# Altium project LimeSDR-Mini_2v2.PrjPcb (part 4 of 4)
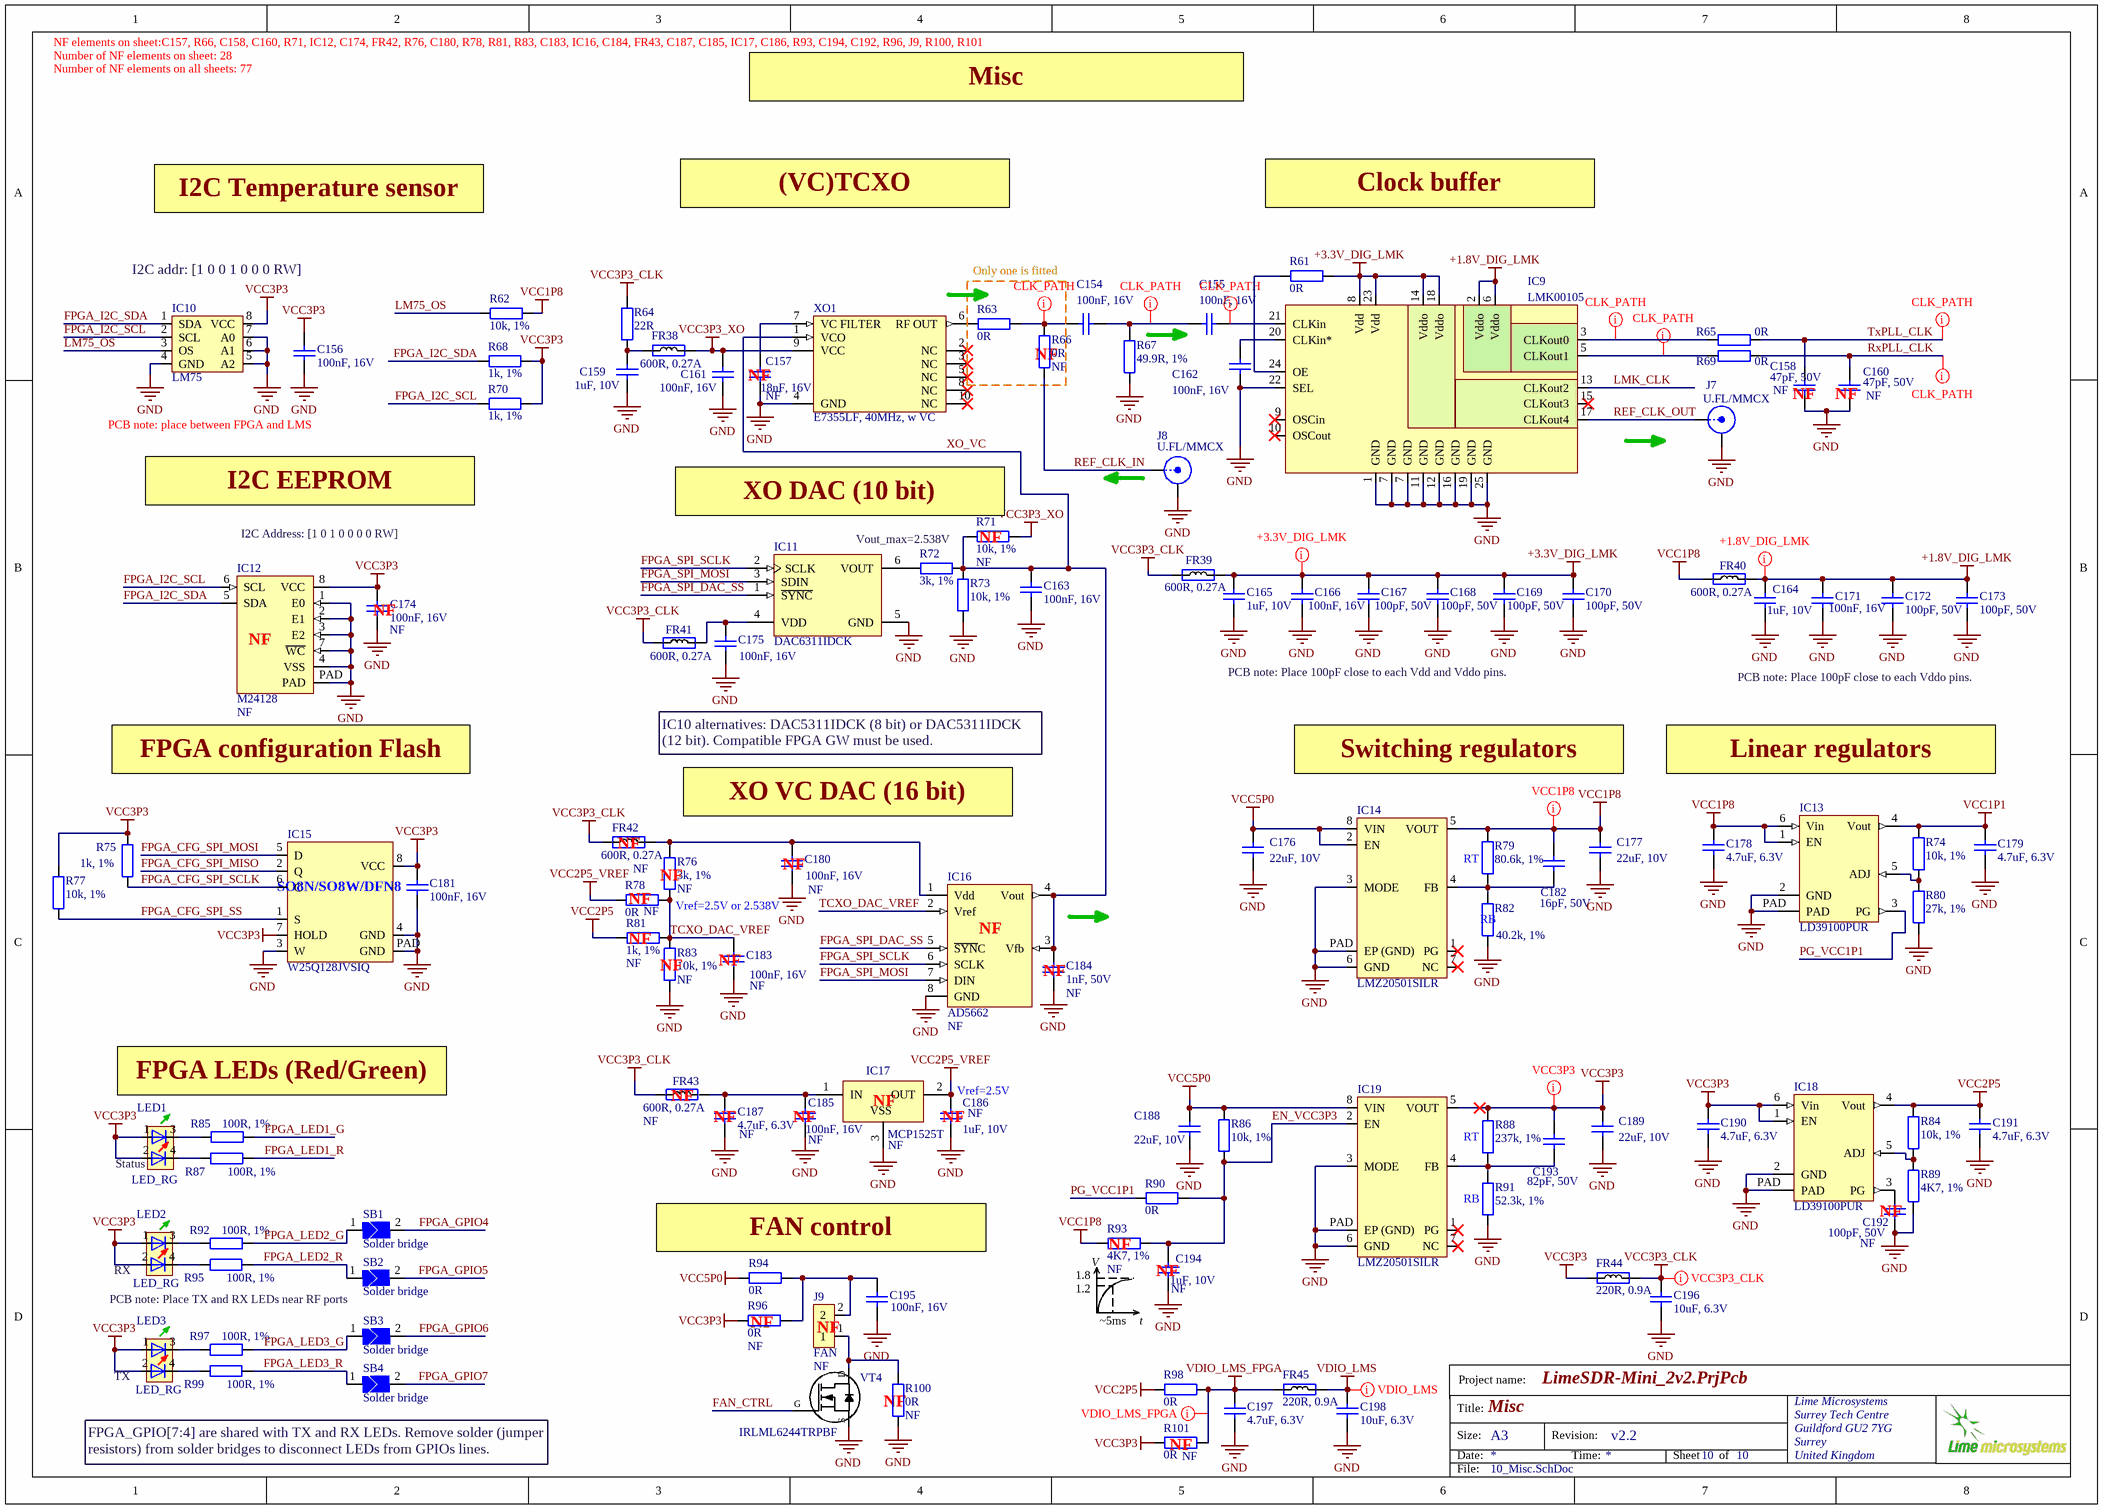
[diagram p109: 10_Misc.SchDoc]

## Sheet 10_Misc.SchDoc: Misc (continued)

### Library data of the parts
C154 C155 C161-C163 C166 C171 = Cap_0402: as C97 on sheet 08_FPGA; Value: 100nF, 16V; Supplier 1: Mouser; Supplier Part Number 1: 81-GRM155R71C104KA88; Case Code - in: 0402; RoHS: RoHS Compliant; Operating Temperature Range: - 55 C to + 125 C; Series: GRM; Termination Style: SMD/SMT; Package / Case: 0402 (1005 metric); Voltage Rating DC: 16 V; Maximum Operating Temperature: + 125 C; Case Code - mm: 1005; Minimum Operating Temperature: - 55 C; Product Category: Low & Medium Capacitance SMD Ceramic Chip Capacitors; Packaging: Reel; Product: General Type MLCCs; Category: Multilayer Ceramic Capacitors MLCC - SMD/SMT; Brand: Murata Electronics; Case Width: 0.5 mm; RoHS - Mouser: Y; Standard Pack Qty: 10000; Minimum Order Quantity: 1; Reeling: True; Manufacturer Part Number 1: GRM155R71C104KA88D
C156 C174 C175 C180 C181 C183 C185 C195 = Cap_0603: as C129 on sheet 09_USB3_0_FIFO; Supplier 1: Mouser; Supplier Part Number 1: 81-GRM155R71C104KA88; Case Code - in: 0402; Manufacturer: Murata Electronics; Category: Multilayer Ceramic Capacitors MLCC - SMD/SMT; Voltage Rating DC: 16 V; Value: 100nF, 16V; Case Code - mm: 1005; Case Width: 0.5 mm; Maximum Operating Temperature: + 125 C; Minimum Operating Temperature: - 55 C; Minimum Order Quantity: 1; Operating Temperature Range: - 55 C to + 125 C; Package / Case: 0402 (1005 metric); Packaging: Reel; Product: General Type MLCCs; Product Category: Low & Medium Capacitance SMD Ceramic Chip Capacitors; Reeling: True; RoHS - Mouser: Y; RoHS: RoHS Compliant; Series: GRM; Standard Pack Qty: 10000; Termination Style: SMD/SMT
  C156 C174 C175 C180 C181 C195: Manufacturer Part Number: GRM155R71C104KA88D
C157 = Cap_0402: Manufacturer: Yageo; Manufacturer Part Number 1: CC0402KRX7R7BB183; Part Description: CAP CER 0.018UF 16V X7R 0402; Temperature Coefficient: X7R; Capacitance: 0.018µF; Tolerance: ±10%; Value: 18nF, 16V; Supplier 1: Digi-Key; Supplier Part Number 1: 311-1706-1-ND; Part Status: Active; Category: Capacitors; Packaging: Cut Tape (CT); Voltage - Rated: 16V; RoHS: RoHS Compliant; Size / Dimension: 0.039" L x 0.020" W (1.00mm x 0.50mm); Package / Case: 0402 (1005 Metric); Mounting Type: Surface Mount, MLCC; Thickness (Max): 0.022" (0.55mm); Applications: General Purpose; Operating Temperature: -55°C ~ 125°C
C158 C160 = Cap_0402: Manufacturer Part Number 1: GRM1555C1H470FA01D; Manufacturer: TDK Corporation; Part Description: 47pF ±1% 50V C0G, NP0 Ceramic Capacitor -55°C ~ 125°C Surface Mount, MLCC 0402 (1005 Metric) 0.039" L x 0.020" W (1.00mm x 0.50mm); Temperature Coefficient: C0G, NP0; Tolerance: ±1%; Value: 47pF, 50V; Supplier 1: Digi-Key; Supplier Part Number 1: 490-6241-1-ND; Package / Case: 0402 (1005 Metric); Voltage - Rated: 50V; Lead Spacing: -; Ratings: -; Mounting Type: Surface Mount, MLCC; Operating Temperature: -55°C ~ 125°C; Thickness (Max): 0.022" (0.55mm); Capacitance: 47pF; Packaging: Cut Tape (CT); Features: -; Applications: General Purpose; Lead Style: -; Size / Dimension: 0.039" L x 0.020" W (1.00mm x 0.50mm); Height - Seated (Max): -; RoHS: RoHS Compliant; Category: Capacitors
C159 C164 C165 C186 C194 = Cap_0402: Manufacturer Part Number 1: C1005X5R1E105K050BC; Manufacturer: TDK; Part Description: 1µF ±10% 10V X5R Ceramic Capacitor -55°C ~ 85°C Surface Mount, MLCC 0402 (1005 Metric) 0.039" L x 0.020" W (1.00mm x 0.50mm); Voltage Rating: 10; Capacitance Tolerance: ± 10%; Product Range: TDK - C Series; Ceramic Capacitor Case: 0402 [1005 Metric]; Capacitance: 1; Dielectric Characteristic: X6; Value: 1uF, 10V; Supplier 1: Digi-Key; Supplier Part Number 1: 445-9066-1-ND; MSL: -; RoHS: YES
C167-C170 C172 C173 C192 = Cap_0402: Manufacturer Part Number 1: CC0402JRNPO9BN101; Manufacturer: Yageo; Part Description: 100pF ±5% 50V C0G, NP0 Ceramic Capacitor -55°C ~ 125°C Surface Mount, MLCC 0402 (1005 Metric) 0.039" L x 0.020" W (1.00mm x 0.50mm); Temperature Coefficient: C0G, NP0; Tolerance: ±5%; Value: 100pF, 50V; Supplier 1: Digi-Key; Supplier Part Number 1: 311-1024-1-ND; RoHS: RoHS Compliant; Category: Capacitors; Applications: General Purpose; Mounting Type: Surface Mount, MLCC; Capacitance: 100pF; Ratings: -; Packaging: Cut Tape (CT); Voltage - Rated: 50V; Size / Dimension: 0.039" L x 0.020" W (1.00mm x 0.50mm); Height - Seated (Max): -; Package / Case: 0402 (1005 Metric); Operating Temperature: -55°C ~ 125°C; Features: -; Lead Spacing: -; Lead Style: -; Thickness (Max): 0.022" (0.55mm)
C176 C177 C188 C189 = Cap_0603: Manufacturer Part Number 1: C1608X5R1A226M080AC; Manufacturer: TDK Corporation; Part Description: 22µF ±20% 10V X5R Ceramic Capacitor -55°C ~ 85°C Surface Mount, MLCC 0603 (1608 Metric) 0.063" L x 0.031" W (1.60mm x 0.80mm); Brand: TDK; Temperature Coefficient / Code: +/- 15 %; Tolerance: 20 %; Type: Multilayer Ceramic Chip Capacitor; Supplier 1: Mouser; Supplier Part Number 1: 810-C1608X5R1A226M; Package / Case: 0603 (1608 metric); Category: Multilayer Ceramic Capacitors MLCC - SMD/SMT; Capacitance: 22 uF; Operating Temperature Range: - 55 C to + 85 C; Case Code - in: 0603; Voltage Rating DC: 10 V; Case Code - mm: 1608; Value: 22uF, 10V
C178 C179 C187 C190 C191 C197 = Cap_0402: Manufacturer: Murata Electronics North America; Manufacturer Part Number 1: GRM155R60J475ME87D; Part Description: 4.7µF ±20% 6.3V X5R Ceramic Capacitor -55°C ~ 85°C Surface Mount, MLCC 0402 (1005 Metric) 0.039" L x 0.020" W (1.00mm x 0.50mm); Tolerance: ±20%; Capacitance: 4.7µF; Temperature Coefficient: X5R; Lead Style: -; Ratings: -; Height - Seated (Max): -; Thickness (Max): 0.022" (0.55mm); Voltage - Rated: 6.3V; Packaging: Cut Tape (CT); Lead Spacing: -; Category: Capacitors; Supplier Part Number 1: 490-5408-1-ND; Applications: General Purpose; Operating Temperature: -55°C ~ 85°C; Mounting Type: Surface Mount, MLCC; Features: Derating Recommended; RoHS: RoHS Compliant; Supplier 1: Digi-Key; Package / Case: 0402 (1005 Metric); Size / Dimension: 0.039" L x 0.020" W (1.00mm x 0.50mm); Value: 4.7uF, 6.3V
C182 = Cap_0402: Part Description: 16 pF ±5% 50V Ceramic Capacitor C0G, NP0 0402 (1005 Metric); Manufacturer: Yageo; Manufacturer Part Number 1: CC0402JRNPO9BN160; Tolerance: 5%; Dielectric: C0G; Value: 16pF, 50V; Supplier 1: Digi-Key; Supplier Part Number 1: 311-1662-1-ND; Stock 1: 168271; Pricing 1: 1=0,10000, 10=0,03700, 50=0,02020, 100=0,01640, 500=0,01174, 1000=0,00922, 2500=0,00838, 5000=0,00771 (USD); RoHS: Yes; Mount: Surface Mount; Case/Package: 0402; Case Code (Imperial): 0402; Case Code (Metric): 1005; Weight: 2.3E-05oz; Min Operating Temperature: -55°C; Max Operating Temperature: 125°C; Capacitance: 16pF; Packaging: Tape and Reel; Voltage Rating (DC): 50V; Voltage Rating: 50V; Termination: SMD/SMT; Resistor Type: Ceramic; Series: CC; Length: 0.039inch; Width: 0.02inch; Thickness: 0.022inch; Depth: 0.5mm; Lead Free: Lead Free; RoHS Compliant: Yes; ComponentLink1URL: http://www.mouser.com/ds/2/447/Yageo_UPY-GP_NP0_16V-to-50V_9-358835.pdf?src-supplier=Mouser; ComponentLink1Description: http://www.mouser.com/ds/2/447/Yageo_UPY-GP_NP0_16V-to-50V_9-358835.pdf?src-supplier=Mouser; ComponentLink2URL: http://www.yageo.com/documents/recent/UPY-GP_NP0_16V-to-50V_16.pdf?src-supplier=Digi-Key; ComponentLink2Description: http://www.yageo.com/documents/recent/UPY-GP_NP0_16V-to-50V_16.pdf?src-supplier=Digi-Key
C184 = Cap_0402: Manufacturer Part Number 1: GCM155R71H102KA37D; Part Description: 1000pF ±10% 50V X7R Ceramic Capacitor -55°C ~ 125°C Surface Mount, MLCC 0402 (1005 Metric) 0.039" L x 0.020" W (1.00mm x 0.50mm); Capacitance: 1000 pF; Type: Automotive Ultra Small MLCC; Tolerance: 10 %; Brand: Murata Electronics; Case Height: 0.5 mm; Case Length: 1 mm; Dielectric: X7R; Temperature Coefficient / Code: +/- 15 %; Value: 1nF, 50V; Supplier 1: Mouser; Supplier Part Number 1: 81-GCM155R71H102KA7D; Case Code - in: 0402; Package / Case: 0402 (1005 metric); Termination Style: SMD/SMT; Packaging: Reel; Operating Temperature Range: - 55 C to + 125 C; Maximum Operating Temperature: + 125 C; Manufacturer: Murata Electronics; Category: Multilayer Ceramic Capacitors MLCC - SMD/SMT; RoHS: RoHS Compliant; Series: GCM; Case Width: 0.5 mm; Voltage Rating DC: 50 V; Case Code - mm: 1005; Product: Automotive MLCCs; Standard Pack Qty: 10000; Reeling: True; RoHS - Mouser: Y; Minimum Order Quantity: 1; Product Category: Automotive Ceramic Chip Capacitors; Minimum Operating Temperature: - 55 C
C193 = Cap_0402: Part Description: 82 pF ±5% 50V Ceramic Capacitor CH 0402 (1005 Metric); Manufacturer: Taiyo Yuden; Manufacturer Part Number 1: UMK105CH820JVHF; Description: Cap Cer 82PF 50V Ch 0402; Value: 82pF, 50V; Supplier 1: Digi-Key; Supplier Part Number 1: 587-5099-1-ND; Stock 1: 10720; Pricing 1: 1=0,10000, 10=0,03000, 50=0,01640, 100=0,01340, 500=0,00954, 1000=0,00750, 2500=0,00682, 5000=0,00627 (USD); RoHS: Yes
C196 C198 = Cap_0603: as C99 on sheet 08_FPGA; Supplier 1: Digi-Key; Supplier Part Number 1: 311-1448-2-ND; Package / Case: 0603 (1608 Metric); Category: Capacitors; Voltage - Rated: 6.3V; Value: 10uF, 6.3V
FR38-FR43 = Ferrite: Manufacturer Part Number 1: BK0603TS601-T; Manufacturer: Taiyo Yuden; Part Description: FERRITE BEAD 600 OHM 0201 1LN; DC Resistance (DCR): 750 mOhm Max; Filter Type: Differential Mode - Single; Impedance @ Frequency: 600 Ohm @ 100MHz; Current Rating: 270mA; Value: 600R@100MHz; Supplier 1: Digi-Key; Supplier Part Number 1: 587-3277-1-ND; Size / Dimension: 0.024" L x 0.012" W (0.60mm x 0.30mm); Package / Case: 0201 (0603 Metric); Height (Max): 0.013" (0.33mm); Mounting Type: Surface Mount; Packaging: Cut Tape (CT); RoHS: RoHS Compliant; Category: Filters
FR44 FR45 = Ferrite: as FR35 on sheet 09_USB3_0_FIFO; Supplier 1: Digi-Key; Package / Case: 0402 (1005 Metric); Category: Filters; Supplier Part Number 1: 445-9329-2-ND; Value: 220R, 0.9A
IC9 = LMK00105: Manufacturer: Texas Instruments; Manufacturer Part Number 1: LMK00105SQ/NOPB; Part Description: IC CLK BUFFER 2:5 200MHZ 24WQFN; Frequency - Max: 200MHz; Voltage - Supply: 2.375 V ~ 3.45 V; Input: HCSL, LVCMOS, LVDS, LVPECL, LVTTL, SSTL, Crystal; Differential - Input:Output: Yes/No; Supplier 1: Digi-Key; Type: Fanout Buffer (Distribution), Multiplexer, Translator; Category: Integrated Circuits (ICs); Operating Temperature: -40°C ~ 85°C; Package / Case: 24-WFQFN Exposed Pad; Supplier Device Package: 24-WQFN (4x4); Supplier Part Number 1: LMK00105SQ/NOPBCT-ND
IC10 = LM75: Manufacturer: NXP Semiconductors; Manufacturer Part Number 1: LM75BTP,147; Part Description: SENSOR TEMPERATURE I2C 8HWSON; Sensing Temperature - Local: -55°C ~ 125°C; Output Type: I²C; Accuracy - Highest (Lowest): ±2°C (±3°C); Voltage - Supply: 2.8 V ~ 5.5 V; Test Condition: -25°C ~ 100°C (-55°C ~ 125°C); Sensor Type: Digital, Local; Resolution: 10 b; Supplier 1: Digi-Key; Operating Temperature: -55°C ~ 125°C; Features: Output Switch, Programmable Limit, Shutdown Mode; Supplier Device Package: 8-HWSON (2x3); Sensing Temperature - Remote: -; Category: Sensors, Transducers; Packaging: Tape & Reel (TR); RoHS: RoHS Compliant; Package / Case: 8-WFDFN Exposed Pad; Supplier Part Number 1: 568-9815-2-ND
IC11 = AD5601BKSZ-REEL7: Single 8-Bit nanoDAC with SPI Interface in LFCSP and SC70, 2.7 to 5.5 V, <100 uA, -40 to +125 degC, KS-6, Pb-Free, Reel; Manufacturer: Texas Instruments; Manufacturer Part Number 1: DAC6311IDCKT; Part Description: 10 Bit Digital to Analog Converter 1 SC-70-6; Max Power Dissipation: 880uW; Max Supply Voltage: 5.5V; Min Supply Voltage: 1.8V; Number of Channels: 1; Operating Supply Voltage: 5V; Settling Time: 6us; Number of Bits: 10; Resolution: 10b; Sampling Rate: 225KS/s; Polarity: Unipolar; Integral Nonlinearity (INL): 0.5LSB; Spurious-free dynamic range (SFDR): 65dB; Signal to Noise Ratio (SNR): 81dB; Nominal Supply Current: 110uA; Output Type: Voltage; ComponentLink1URL: http://www.ti.com/lit/ds/symlink/dac5311.pdf; ComponentLink1Description: http://www.ti.com/lit/ds/symlink/dac5311.pdf; Supplier 1: Digi-Key; Supplier Part Number 1: 296-23716-1-ND; Stock 1: 13410; Pricing 1: 1=2,37000, 10=2,13100, 25=2,01000, 100=1,71250 (USD); RoHS: Yes; Case/Package: SC; Number of Pins: 6; Contact Plating: Gold; Min Operating Temperature: -40°C; Max Operating Temperature: 125°C; Package Quantity: 1; Packaging: Tape and Reel; Number of DAC Channels: 1; Interface: SPI; Number of Converters: 1; Number of D/A Converters: 1; Termination: SMD/SMT; Supply Type: Single; Conversion Rate: 225KS/s; Differential Nonlinearity: 0.5LSB; Length: 2mm; Width: 1.25mm; Height: 0.9mm; Radiation Hardening: No; REACH SVHC: No SVHC; Lead Free: Lead Free; RoHS Compliant: Yes; ComponentLink2URL: https://datasheet.ciiva.com/1362/dac7311-1362880.pdf?src-supplier=Digi-Key; ComponentLink2Description: https://datasheet.ciiva.com/1362/dac7311-1362880.pdf?src-supplier=Digi-Key; ComponentLink3URL: https://datasheet.ciiva.com/4779/sbas442a-125649-4779152.pdf?src-supplier=Mouser; ComponentLink3Description: https://datasheet.ciiva.com/4779/sbas442a-125649-4779152.pdf?src-supplier=Mouser; ComponentLink4URL: https://datasheet.ciiva.com/1494/1833965-1494412.pdf?src-supplier=Element14; ComponentLink4Description: https://datasheet.ciiva.com/1494/1833965-1494412.pdf?src-supplier=Element14; ComponentLink5URL: https://datasheet.ciiva.com/1503/dac5311-1503186.pdf?src-supplier=Farnell; ComponentLink5Description: https://datasheet.ciiva.com/1503/dac5311-1503186.pdf?src-supplier=Farnell; ComponentLink6URL: https://datasheet.ciiva.com/46391/1833965-46391478.pdf?src-supplier=Element14; ComponentLink6Description: https://datasheet.ciiva.com/46391/1833965-46391478.pdf?src-supplier=Element14; ComponentLink7URL: https://datasheet.ciiva.com/1368/dac5311-1368577.pdf?src-supplier=Digi-Key; ComponentLink7Description: https://datasheet.ciiva.com/1368/dac5311-1368577.pdf?src-supplier=Digi-Key; ComponentLink8URL: https://datasheet.ciiva.com/1368/dac5311-1368578.pdf?src-supplier=Digi-Key; ComponentLink8Description: https://datasheet.ciiva.com/1368/dac5311-1368578.pdf?src-supplier=Digi-Key; ComponentLink9URL: https://datasheet.ciiva.com/15146/getdatasheetpartid-213912-15146949.pdf?src-supplier=Verical; ComponentLink9Description: https://datasheet.ciiva.com/15146/getdatasheetpartid-213912-15146949.pdf?src-supplier=Verical
IC12 = M24128-DFMC6TG: Manufacturer: STMicroelectronics; Part Description: EEPROM Memory IC 128Kb (16K x 8) I²C 1MHz 450ns 8-UFDFPN (2x3); Memory Type: Non-Volatile; Memory Format: EEPROM; Memory Size: 128Kb (16K x 8); Write Cycle Time - Word, Page: 5ms; Memory Interface: I²C; Voltage - Supply: 1.7 V ~ 5.5 V; Supplier 1: Digi-Key; Manufacturer Part Number 1: M24128-DFMC6TG; RoHS: RoHS Compliant; Category: Integrated Circuits (ICs); Stock 1: 5894; Pricing 1: 1=0.35, 10=0.348, 100=0.2854, 500=0.27748, 1000=0.27004 (USD); Packaging: Cut Tape (CT); Part Status: Active; Technology: EEPROM; Operating Temperature: -40°C ~ 85°C (TA); Mounting Type: Surface Mount; Package / Case: 8-UFDFN Exposed Pad; Supplier Device Package: 8-UFDFPN (2x3); ComponentLink1URL: http://www.st.com/content/ccc/resource/technical/document/datasheet/59/05/c9/5b/7b/41/48/b6/CD00259167.pdf/files/CD00259167.pdf/jcr:content/translations/en.CD00259167.pdf; ComponentLink1Description: http://www.st.com/content/ccc/resource/technical/document/datasheet/59/05/c9/5b/7b/41/48/b6/CD00259167.pdf/files/CD00259167.pdf/jcr:content/translations/en.CD00259167.pdf; Supplier Part Number 1: 497-15739-1-ND
IC13 IC18 = LD39100PUR: Manufacturer: STMicroelectronics; Part Description: Linear Voltage Regulator IC Positive Adjustable Output 0.8 V ~ 4.5 V 1A 6-DFN (3x3); Output Configuration: Positive; Output Type: Adjustable; Voltage - Input (Max): 5.5V; Voltage - Output (Min/Fixed): 0.8V; Voltage - Output (Max): 4.6V; Voltage Dropout (Max): 0.4V @ 1A; Current - Output: 1A; Current - Supply: 50µA ~ 300µA; PSRR: 70dB ~ 65dB (1kHz ~ 10kHz); Control Features: Enable, Power Good; Protection Features: Over Current, Over Temperature, Short Circuit; Supplier 1: Digi-Key; Manufacturer Part Number 1: LD39100PUR; RoHS: RoHS Compliant; Category: Integrated Circuits (ICs); Stock 1: 27970; Pricing 1: 1=0.85, 10=0.76, 100=0.5923, 500=0.48926, 1000=0.38625 (USD); Packaging: Cut Tape (CT); Part Status: Active; Operating Temperature: -40°C ~ 125°C; Mounting Type: Surface Mount; Package / Case: 6-VDFN Exposed Pad; Supplier Device Package: 6-DFN (3x3); ComponentLink1URL: http://www.st.com/content/ccc/resource/technical/document/datasheet/72/02/e5/ee/df/36/40/5e/CD00233788.pdf/files/CD00233788.pdf/jcr:content/translations/en.CD00233788.pdf; ComponentLink1Description: http://www.st.com/content/ccc/resource/technical/document/datasheet/72/02/e5/ee/df/36/40/5e/CD00233788.pdf/files/CD00233788.pdf/jcr:content/translations/en.CD00233788.pdf; Supplier Part Number 1: 497-11013-1-ND
IC14 IC19 = LMZ20501SILR_DC-DC: Manufacturer: Texas Instruments; Part Description: Non-Isolated PoL Module DC DC Converter 1 Output 0.8 ~ 3.6V 1A 2.7V - 5.5V Input; Number of Outputs: 1; Min Input Voltage: 2.7V; Max Input Voltage: 5.5V; Voltage - Output 1: 3.6V; Max Output Current: 1A; Efficiency: 93%; Max Power Dissipation: 4W; Quiescent Current: 72nA; Switching Frequency: 3MHz; Output Type: Adjustable; Supplier 1: Digi-Key; Supplier Part Number 1: 296-40328-1-ND; Manufacturer Part Number 1: LMZ20501SILR; Stock 1: 8106; Pricing 1: 1=4,48000, 10=4,02000, 25=3,80040, 100=3,29350, 250=3,12464, 500=2,80372, 1000=2,54942 (USD); RoHS: Yes; Mount: Surface Mount; Case/Package: SMD/SMT; Number of Pins: 8; Min Operating Temperature: -40°C; Max Operating Temperature: 125°C; Packaging: Tape and Reel; Output Voltage: 3.6V; Package Quantity: 3000; Features: UVLO,OCP,OTP,SCP; Operating Supply Voltage: 5.5V; Length: 0.14inch; Width: 0.14inch; Height: 0.07inch; Lead Free: Lead Free; RoHS Compliant: Yes; ComponentLink1URL: http://www.ti.com/lit/pdf/snaa214?src-supplier=Digi-Key; ComponentLink1Description: http://www.ti.com/lit/pdf/snaa214?src-supplier=Digi-Key; ComponentLink2URL: http://www.ti.com/lit/ds/symlink/lmz20501.pdf?src-supplier=Digi-Key; ComponentLink2Description: http://www.ti.com/lit/ds/symlink/lmz20501.pdf?src-supplier=Digi-Key; ComponentLink3URL: http://www.ti.com/lit/gpn/lmz20501?src-supplier=Mouser; ComponentLink3Description: http://www.ti.com/lit/gpn/lmz20501?src-supplier=Mouser; ComponentLink4URL: http://www.ti.com/general/docs/lit/getliterature.tsp?genericPartNumber=LMZ20501&&fileType=pdf&src-supplier=Avnet; ComponentLink4Description: http://www.ti.com/general/docs/lit/getliterature.tsp?genericPartNumber=LMZ20501&&fileType=pdf&src-supplier=Avnet
IC15 = M25P40_with_pad: Manufacturer: Winbond; Part Description: FLASH - NOR Memory IC 128Mb (16M x 8) SPI - Quad I/O, QPI, DTR 133 MHz 8-SOIC; Memory Type: FLASH,NOR; Frequency: 104MHz; Interface: SPI,Serial; Supplier 1: Digi-Key; Supplier Part Number 1: W25Q128JVSIQ-ND; Manufacturer Part Number 1: W25Q128JVSIQ; Stock 1: 7729; Pricing 1: 1=1,88000, 10=1,71400, 25=1,66760, 50=1,65880, 100=1,48280, 250=1,47852, 500=1,45618, 1000=1,39437, 5000=1,29820 (USD); RoHS: Yes; Case/Package: SOIC; Min Operating Temperature: -40°C; Max Operating Temperature: 85°C; Packaging: Tray; RoHS Compliant: Yes; ComponentLink1URL: http://www.winbond.com/resource-files/w25q128jv%20revf%2003272018%20plus.pdf?src-supplier=Digi-Key; ComponentLink1Description: http://www.winbond.com/resource-files/w25q128jv%20revf%2003272018%20plus.pdf?src-supplier=Digi-Key
IC16 = AD5662: Manufacturer: Analog Devices Inc.; Manufacturer Part Number 1: AD5662BRJZ-2REEL7; Part Description: IC DAC 16BIT BUFF V-OUT SOT23-8; Number of Bits: 16; Number of D/A Converters: 1; Settling Time: 10µs; Output Type: Voltage - Buffered; Differential Output: No; Data Interface: SPI, DSP; Reference Type: External; Voltage - Supply, Analog: 2.7 V ~ 5.5 V; INL/DNL (LSB): ±8, ±1 (Max); Architecture: String DAC; Supplier 1: Digi-Key; RoHS: RoHS Compliant; Category: Integrated Circuits (ICs); Stock 1: 2784; Pricing 1: 1=7.55, 10=6.821, 100=5.6469, 500=4.91722, 1000=4.28274 (USD); Packaging: Cut Tape (CT); Part Status: Active; Voltage - Supply, Digital: 2.7 V ~ 5.5 V; Operating Temperature: -40°C ~ 125°C; Package / Case: SOT-23-8; Supplier Device Package: SOT-23-8; ComponentLink1URL: http://www.analog.com/media/en/technical-documentation/data-sheets/AD5662.pdf; ComponentLink1Description: http://www.analog.com/media/en/technical-documentation/data-sheets/AD5662.pdf; Supplier Part Number 1: AD5662BRJZ-2REEL7CT-ND
IC17 = MCP1525T-I/TT: 2.5V Voltage Reference, 3-Pin SOT-23, Industrial Temperature, Tape and Reel; Manufacturer: Microchip Technology; Part Description: Series Voltage Reference IC ±1% 2mA SOT-23-3; Reference Type: Series; Output Type: Fixed; Current - Output: 2mA; Tolerance: ±1%; Temperature Coefficient: 50ppm/°C; Noise - 0.1Hz to 10Hz: 90µVp-p; Noise - 10Hz to 10kHz: 500µVrms; Voltage - Input: 2.7 V ~ 5.5 V; Current - Supply: 120µA; PackageDescription: Series Voltage Reference IC ±1% 2mA SOT-23-3; Supplier 1: Digi-Key; Manufacturer Part Number 1: MCP1525T-I/TT; RoHS: RoHS Compliant; Category: Integrated Circuits (ICs); Stock 1: 16612; Pricing 1: 1=0.77, 25=0.64, 100=0.58 (USD); Packaging: Digi-Reel®; Part Status: Active; Voltage - Output (Min/Fixed): 2.5V; Voltage - Output (Max): -; Current - Cathode: -; Operating Temperature: -40°C ~ 85°C (TA); Mounting Type: Surface Mount; Package / Case: TO-236-3, SC-59, SOT-23-3; Supplier Device Package: SOT-23-3; ComponentLink1URL: http://www.microchip.com/mymicrochip/filehandler.aspx?ddocname=en011331; ComponentLink1Description: http://www.microchip.com/mymicrochip/filehandler.aspx?ddocname=en011331; Supplier Part Number 1: MCP1525T-I/TTDKR-ND
J7 J8 = RF_IF_connector: CONN UMC RCPT STR 50 OHM SMD; Manufacturer: Molex, LLC; Manufacturer Part Number 1: 0734120110; Part Description: Ultra Miniature Coaxial Connector Receptacle, Male Pin 50 Ohm Surface Mount Solder; Body Finish: Nickel; Body Material: Phosphor Bronze; Center Contact Material: Brass; Center Contact Plating: Gold; Connector Style: Ultra Miniature Coaxial; Connector Type: Jack, Male Pin; Contact Termination: Solder; Dielectric Material: Liquid Crystal Polymer (LCP); Frequency - Max: 6GHz; Impedance: 50 Ohm; Voltage Rating: 60V; Cable Group: -; Category: Connectors, Interconnects; Fastening Type: Snap-On; Features: -; Housing Color: Silver; Ingress Protection: -; Mounting Type: Surface Mount; Operating Temperature: -40°C ~ 90°C; Packaging: Cut Tape (CT); RoHS: RoHS Compliant; Shield Termination: Solder; Supplier 1: Digi-Key; Supplier Part Number 1: WM5587CT-ND
J9 = Jumper: Manufacturer Part Number 1: 961102-6404-AR; Part Description: 2 Positions Header, Unshrouded Connector 0.100" (2.54mm) Through Hole Gold; Manufacturer: 3M; Connector Type: Header, Unshrouded; Supplier 1: Digi-Key; Supplier Part Number 1: 3M9447-ND; Contact Type: Male Pin; Color: Black; Mounting Type: Through Hole; Category: Connectors, Interconnects; Contact Finish: Gold
LED1-LED3 = LED_green_red_SMD: Manufacturer Part Number 1: HSMF-C165; Manufacturer: Avago Technologies US Inc.; Part Description: LED GREEN/RED DIFFUSED 0603 SMD; Millicandela Rating: 15mcd Green, 10mcd Red; Lens Transparency: Diffused; Lens Color: White; Lens Style/Size: Rectangle with Flat Top, 1.60mm x 0.80mm; Wavelength - Peak: 570nm Green, 636nm Red; Wavelength - Dominant: 572nm Green, 621nm Red; Viewing Angle: 120°; Voltage - Forward (Vf) (Typ): 2.2V Green, 1.95V Red; Current - Test: 20mA; Color: Green, Red; Supplier 1: Digi-Key; Height (Max): 0.50mm; Packaging: Cut Tape (CT); Category: Optoelectronics; Mounting Type: Surface Mount; Package / Case: 0603 (1608 Metric); Size / Dimension: 1.60mm L x 0.80mm W; Supplier Device Package: *; RoHS: RoHS Compliant; Supplier Part Number 1: 516-1419-1-ND
R61 R63 R66 R78 R90 R94 R96 R100 = Res_0402: as R53 on sheet 09_USB3_0_FIFO; Value: 0R; Supplier 1: Digi-Key; Supplier Part Number 1: 311-0.0JRTR-ND; Category: Resistors; Temperature Coefficient: -; Features: Moisture Resistant; Supplier Device Package: 0402; Height: 0.016" (0.40mm); Package / Case: 0402 (1005 Metric); Operating Temperature: -55°C ~ 155°C; Size / Dimension: 0.039" L x 0.020" W (1.00mm x 0.50mm); Composition: Thick Film; Packaging: Tape & Reel (TR); Number of Terminations: 2; RoHS: RoHS Compliant
R62 R71 R73 R74 R77 R83 R84 R86 = Res_0402: as R54-R56 on sheet 09_USB3_0_FIFO; Value: 10k, 1%; Supplier 1: Digi-Key; Supplier Part Number 1: 311-10.0KLRTR-ND; Resistance (Ohms): 10k; Packaging: Tape & Reel (TR); RoHS: RoHS Compliant; Package / Case: 0402 (1005 Metric); Tolerance: ±1%; Operating Temperature: -55°C ~ 155°C; Size / Dimension: 0.039" L x 0.020" W (1.00mm x 0.50mm); Number of Terminations: 2; Category: Resistors; Height: 0.016" (0.40mm); Supplier Device Package: 0402; Features: Moisture Resistant; Composition: Thick Film
R64 = Res_0402: as R59 on sheet 09_USB3_0_FIFO; Supplier 1: Digi-Key; Supplier Part Number 1: 311-22.0LRTR-ND; Supplier Device Package: 0402; Composition: Thick Film; Category: Resistors; Value: 22R
R65 R69 R98 R101 = Res_0402: as R42-R46 on sheet 08_FPGA; Supplier 1: Digi-Key; Supplier Part Number 1: 311-0.0JRTR-ND; Composition: Thick Film; Package / Case: 0402 (1005 Metric); Category: Resistors; Value: 0R; Features: Moisture Resistant; Height: 0.016" (0.40mm); Number of Terminations: 2; Operating Temperature: -55°C ~ 155°C; Packaging: Tape & Reel (TR); RoHS: RoHS Compliant; Size / Dimension: 0.039" L x 0.020" W (1.00mm x 0.50mm); Supplier Device Package: 0402; Temperature Coefficient: -
R67 = Res_0402: Manufacturer: Samsung Electro-Mechanics America, Inc.; Manufacturer Part Number 1: RC1005F49R9CS; Part Description: RES SMD 49.9 OHM 1% 1/16W 0402; Temperature Coefficient: ±100ppm/°C; Resistance (Ohms): 49.9; Power (Watts): 0.063W, 1/16W; Number of Terminations: 2; Size / Dimension: 0.039" L x 0.020" W (1.00mm x 0.50mm); Supplier Device Package: 0402 (1005 Metric); RoHS: RoHS Compliant; Supplier Part Number 1: 1276-3469-6-ND; Features: -; Packaging: Digi-Reel®; Tolerance: ±1%; Height: 0.016" (0.40mm); Category: Resistors; Composition: Thick Film; Package / Case: 0402 (1005 Metric); Supplier 1: Digi-Key; Operating Temperature: -55°C ~ 155°C; Value: 49.9R, 1%
R68 R70 R75 R81 = Res_0402: Manufacturer: Stackpole Electronics Inc; Manufacturer Part Number 1: RMCF0402FT1K00; Part Description: RES SMD 1K OHM 1% 1/16W 0402; Temperature Coefficient: ±100ppm/°C; Power (Watts): 0.063W, 1/16W; Value: 1k, 1%; Supplier 1: Digi-Key; Supplier Part Number 1: RMCF0402FT1K00TR-ND; Package / Case: 0402 (1005 Metric); Supplier Device Package: 0402; Height: 0.016" (0.40mm); Size / Dimension: 0.039" L x 0.020" W (1.00mm x 0.50mm); Number of Terminations: 2; Category: Resistors; Composition: Thick Film; Resistance (Ohms): 1k; Tolerance: ±1%; Operating Temperature: -55°C ~ 155°C; RoHS: RoHS Compliant
  R68 R70 R75: Packaging: Cut Tape (CT); Features: Moisture Resistant
  R81: Packaging: Tape & Reel (TR); Features: -
R72 R76 = Res_0402: Manufacturer: Vishay Dale; Part Description: RES SMD 3K OHM 1% 1/16W 0402; Manufacturer Part Number 1: RMCF0402FT3K00; Temperature Coefficient: ±100ppm/°C; Power (Watts): 0.063W, 1/16W; Value: 3k, 1%; Category: Resistors; Tolerance: ±1%; RoHS: RoHS Compliant; Composition: Thick Film; Number of Terminations: 2; Operating Temperature: -55°C ~ 155°C; Supplier Device Package: 0402 (1005 Metric); Supplier Part Number 1: RMCF0402FT3K00TR-ND; Packaging: Cut Tape (CT); Supplier 1: Digi-Key; Package / Case: 0402 (1005 Metric); Features: Automotive AEC-Q200; Resistance (Ohms): 3k; Height: 0.016" (0.40mm); Size / Dimension: 0.039" L x 0.020" W (1.00mm x 0.50mm)
R79 = Res_0402: Part Description: 80.6 kOhms ±1% 0.063W, 1/16W Chip Resistor 0402 (1005 Metric) Automotive AEC-Q200 Thick Film; Manufacturer: Stackpole Electronics; Manufacturer Part Number 1: RMCF0402FT80K6; Resistance: 80.6kR; Max Power Dissipation: 63mW; Temperature Coefficient: 100ppm/°C; Value: 80.6k, 1%; Supplier 1: Digi-Key; Supplier Part Number 1: RMCF0402FT80K6CT-ND; Stock 1: 329079; Pricing 1: 1=0,10000, 10=0,01300, 100=0,00550, 1000=0,00246, 2500=0,00213, 5000=0,00176 (USD); RoHS: Yes; Mount: Surface Mount; Case/Package: 0402; Case Code (Metric): 1005; Case Code (Imperial): 0402; Contact Plating: Tin,Matte; Min Operating Temperature: -55°C; Max Operating Temperature: 155°C; Tolerance: 1%; Features: Automotive AEC-Q200; Packaging: Tape and Reel; Resistor Type: Thick Film; Number of Terminations: 2; Series: RMCF; Length: 0.039inch; Width: 0.02inch; Height: 0.016inch; Radiation Hardening: No; Lead Free: Lead Free; RoHS Compliant: Yes; ComponentLink1URL: https://www.seielect.com/catalog/SEI-Packaging.pdf?src-supplier=Digi-Key; ComponentLink1Description: https://www.seielect.com/catalog/SEI-Packaging.pdf?src-supplier=Digi-Key; ComponentLink2URL: https://www.seielect.com/catalog/SEI-RMCF_RMCP.pdf?src-supplier=Avnet; ComponentLink2Description: https://www.seielect.com/catalog/SEI-RMCF_RMCP.pdf?src-supplier=Avnet; ComponentLink3URL: https://www.seielect.com/Catalog/SEI-RMCF_RMCP.pdf?src-supplier=Digi-Key; ComponentLink3Description: https://www.seielect.com/Catalog/SEI-RMCF_RMCP.pdf?src-supplier=Digi-Key
R80 = Res_0402: Manufacturer: Yageo; Manufacturer Part Number 1: RC0402FR-0727KL; Part Description: 27 kOhms ±1% 0.063W, 1/16W Chip Resistor 0402 (1005 Metric) Moisture Resistant Thick Film; Resistance: 27kR; Power Rating: 63mW; Temperature Coefficient: 100ppm/°C; Voltage Rating: 50V; ComponentLink1URL: http://www.yageo.com/documents/recent/PYu-RC_Group_51_RoHS_L_7.pdf; ComponentLink1Description: http://www.yageo.com/documents/recent/PYu-RC_Group_51_RoHS_L_7.pdf; Supplier 1: Digi-Key; Supplier Part Number 1: 311-27.0KLRCT-ND; Stock 1: 1102573; Pricing 1: 1=0,10000, 10=0,01600, 100=0,00660, 1000=0,00299, 2500=0,00259, 5000=0,00214 (USD); RoHS: Yes; Case/Package: 0402; Case Code (Imperial): 0402; Case Code (Metric): 1005; Size Code: 0402; Min Operating Temperature: -55°C; Max Operating Temperature: 155°C; Tolerance: 1%; Packaging: Tape and Reel; Package Quantity: 10000; Termination: SMD/SMT; Resistor Type: Thick Film; Number of Terminations: 2; Max Power Dissipation: 63mW; Features: Moisture Resistant; Series: RC; Resistance Tolerance: 1%; Construction: Rectangular; Technology: THICK FILM; Length: 1mm; Width: 0.02inch; Height: 0.016inch; Depth: 0.5mm; REACH SVHC: Unknown; Lead Free: Lead Free; Military Standard: Not; RoHS Compliant: Yes; Value: 27k, 1%
R82 = Res_0402: Part Description: 40.2 kOhms ±1% 0.063W, 1/16W Chip Resistor 0402 (1005 Metric) Moisture Resistant Thick Film; Manufacturer: Yageo; Manufacturer Part Number 1: RC0402FR-0740K2L; Resistance: 40.2kR; Power Rating: 62.5mW; Voltage Rating: 50V; Temperature Coefficient: 100ppm/°C; Max Power Dissipation: 63mW; Value: 40.2k, 1%; Supplier 1: Digi-Key; Supplier Part Number 1: 311-40.2KLRCT-ND; Stock 1: 2895359; Pricing 1: 1=0,10000, 10=0,01500, 100=0,00600, 1000=0,00267, 2500=0,00232, 5000=0,00192 (USD); RoHS: Yes; Case/Package: 0402; Case Code (Metric): 1005; Case Code (Imperial): 0402; Contact Plating: Tin,Matte; Size Code: 0402; Min Operating Temperature: -55°C; Max Operating Temperature: 155°C; Package Quantity: 1; Tolerance: 1%; Packaging: Tape and Reel; Resistor Type: Thick Film; Number of Terminations: 2; Termination: SMD/SMT; Features: Moisture Resistant; Series: RC; Construction: Rectangular; Voltage Rating (DC): 50V; Length: 0.039inch; Width: 0.02inch; Height: 0.016inch; Depth: 0.5mm; Military Standard: Not; Lead Free: Lead Free; RoHS Compliant: Yes; ComponentLink1URL: https://datasheet.ciiva.com/2453/pyu-r-int-thick-7-2453437.pdf?src-supplier=Digi-Key; ComponentLink1Description: https://datasheet.ciiva.com/2453/pyu-r-int-thick-7-2453437.pdf?src-supplier=Digi-Key; ComponentLink2URL: https://datasheet.ciiva.com/2453/pyu-r-int-thick-7-2453438.pdf?src-supplier=Digi-Key; ComponentLink2Description: https://datasheet.ciiva.com/2453/pyu-r-int-thick-7-2453438.pdf?src-supplier=Digi-Key; ComponentLink3URL: https://datasheet.ciiva.com/2453/pyu-r-int-thick-7-2453436.pdf?src-supplier=Digi-Key; ComponentLink3Description: https://datasheet.ciiva.com/2453/pyu-r-int-thick-7-2453436.pdf?src-supplier=Digi-Key; ComponentLink4URL: https://datasheet.ciiva.com/5557/pyu-rc0402-51-rohs-l-6-r-5557981.pdf?src-supplier=Mouser; ComponentLink4Description: https://datasheet.ciiva.com/5557/pyu-rc0402-51-rohs-l-6-r-5557981.pdf?src-supplier=Mouser; ComponentLink5URL: https://datasheet.ciiva.com/8889/pyu-rc0402-51-rohs-l-6-8889263.pdf?src-supplier=Avnet; ComponentLink5Description: https://datasheet.ciiva.com/8889/pyu-rc0402-51-rohs-l-6-8889263.pdf?src-supplier=Avnet; ComponentLink6URL: https://datasheet.ciiva.com/16744/pyu-rc0402-51-rohs-l-6-r-16744286.pdf?src-supplier=Future+Electronics; ComponentLink6Description: https://datasheet.ciiva.com/16744/pyu-rc0402-51-rohs-l-6-r-16744286.pdf?src-supplier=Future+Electronics
R85 R87 R92 R95 R97 R99 = Res_0402: Manufacturer Part Number 1: RMCF0402FT100R; Manufacturer: Stackpole Electronics Inc.; Part Description: RES SMD 100 OHM 1% 1/16W 0402; Power (Watts): 0.063W, 1/16W; Temperature Coefficient: ±100ppm/°C; Resistance (Ohms): 100; Value: 100R, 1%; Supplier 1: Digi-Key; Supplier Part Number 1: RMCF0402FT100RDKR-ND; Packaging: Digi-Reel®; Composition: Thick Film; Number of Terminations: 2; Package / Case: 0402 (1005 Metric); RoHS: RoHS Compliant; Category: Resistors; Size / Dimension: 0.039" L x 0.020" W (1.00mm x 0.50mm); Tolerance: ±1%; Supplier Device Package: 0402; Features: -; Height: 0.016" (0.40mm); Operating Temperature: -55°C ~ 155°C
R88 = Res_0402: Part Description: 237 kOhms ±1% 0.063W, 1/16W Chip Resistor 0402 (1005 Metric) Moisture Resistant Thick Film; Manufacturer: Yageo; Manufacturer Part Number 1: RC0402FR-07237KL; Resistance: 237kR; Power Rating: 62.5mW; Voltage Rating: 50V; Temperature Coefficient: 100ppm/°C; Max Power Dissipation: 63mW; Value: 237k, 1%; Supplier 1: Digi-Key; Supplier Part Number 1: YAG3064CT-ND; Stock 1: 306971; Pricing 1: 1=0,10000, 10=0,01500, 100=0,00600, 1000=0,00267, 2500=0,00232, 5000=0,00192 (USD); RoHS: Yes; Case/Package: 0402; Case Code (Imperial): 0402; Case Code (Metric): 1005; Contact Plating: Tin,Matte; Size Code: 0402; Min Operating Temperature: -55°C; Max Operating Temperature: 155°C; Tolerance: 1%; Packaging: Tape and Reel; Resistor Type: Thick Film; Termination: SMD/SMT; Number of Terminations: 2; Features: Moisture Resistant; Series: RC; Construction: Rectangular; Length: 1mm; Width: 0.5mm; Height: 0.016inch; Depth: 0.5mm; Military Standard: Not; Lead Free: Lead Free; RoHS Compliant: Yes; ComponentLink1URL: https://datasheet.ciiva.com/17419/pyu-rc0402-51-rohs-l-6-r-17419479.pdf?src-supplier=Future+Electronics; ComponentLink1Description: https://datasheet.ciiva.com/17419/pyu-rc0402-51-rohs-l-6-r-17419479.pdf?src-supplier=Future+Electronics
R89 R93 = Res_0402: as R47 on sheet 08_FPGA; Supplier 1: Digi-Key; Supplier Part Number 1: 311-4.7KLRCT-ND; RoHS: RoHS Compliant; Category: Resistors; Stock 1: 4788231; Pricing 1: 1=0.1, 10=0.014, 100=0.0056, 1000=0.00253, 2500=0.0022, 5000=0.00181 (USD); Packaging: Cut Tape (CT); Part Status: Active; Tolerance: ±1%; Composition: Thick Film; Features: Moisture Resistant; Operating Temperature: -55°C ~ 155°C; Package / Case: 0402 (1005 Metric); Supplier Device Package: 0402; Size / Dimension: 0.039" L x 0.020" W (1.00mm x 0.50mm); Height - Seated (Max): 0.016" (0.40mm); Failure Rate: -; ComponentLink1URL: http://www.yageo.com/documents/recent/PYu-RC_Group_51_RoHS_L_7.pdf; ComponentLink1Description: http://www.yageo.com/documents/recent/PYu-RC_Group_51_RoHS_L_7.pdf; Value: 4K7, 1%
R91 = Res_0402: Part Description: Thick Film Resistors - SMD 0402 52.3Kohms 1% AEC-Q20; Manufacturer: Panasonic; Manufacturer Part Number 1: ERJ-2RKF5232X; Resistance: 52.3kR; Voltage Rating: 50V; Power Rating: 100mW; Temperature Coefficient: 100ppm/°C; Value: 52.3k, 1%; ComponentLink1URL: https://datasheet.ciiva.com/6067/1686128-6067913.pdf?src-supplier=Farnell; ComponentLink1Description: https://datasheet.ciiva.com/6067/1686128-6067913.pdf?src-supplier=Farnell; ComponentLink2URL: https://datasheet.ciiva.com/7983/1018594-7983494.pdf?src-supplier=Element14; ComponentLink2Description: https://datasheet.ciiva.com/7983/1018594-7983494.pdf?src-supplier=Element14; ComponentLink3URL: https://datasheet.ciiva.com/2453/pyu-r-int-thick-7-2453602.pdf?src-supplier=Digi-Key; ComponentLink3Description: https://datasheet.ciiva.com/2453/pyu-r-int-thick-7-2453602.pdf?src-supplier=Digi-Key; ComponentLink4URL: https://datasheet.ciiva.com/2453/pyu-r-int-thick-7-2453603.pdf?src-supplier=Digi-Key; ComponentLink4Description: https://datasheet.ciiva.com/2453/pyu-r-int-thick-7-2453603.pdf?src-supplier=Digi-Key; ComponentLink5URL: https://datasheet.ciiva.com/2453/pyu-r-int-thick-7-2453601.pdf?src-supplier=Digi-Key; ComponentLink5Description: https://datasheet.ciiva.com/2453/pyu-r-int-thick-7-2453601.pdf?src-supplier=Digi-Key; ComponentLink6URL: https://datasheet.ciiva.com/7849/1018594-7849837.pdf?src-supplier=Element14; ComponentLink6Description: https://datasheet.ciiva.com/7849/1018594-7849837.pdf?src-supplier=Element14; ComponentLink7URL: https://datasheet.ciiva.com/7849/1018594-7849836.pdf?src-supplier=Element14; ComponentLink7Description: https://datasheet.ciiva.com/7849/1018594-7849836.pdf?src-supplier=Element14; ComponentLink8URL: https://datasheet.ciiva.com/15189/getdatasheetpartid-326416-15189356.pdf?src-supplier=Verical; ComponentLink8Description: https://datasheet.ciiva.com/15189/getdatasheetpartid-326416-15189356.pdf?src-supplier=Verical; ComponentLink9URL: https://datasheet.ciiva.com/16741/pyu-rc0402-51-rohs-l-6-r-16741080.pdf?src-supplier=Future+Electronics; ComponentLink9Description: https://datasheet.ciiva.com/16741/pyu-rc0402-51-rohs-l-6-r-16741080.pdf?src-supplier=Future+Electronics; Supplier 1: Mouser; Supplier Part Number 1: 667-ERJ-2RKF5232X; Stock 1: 161816; Pricing 1: 1=0,10000, 10=0,03400, 50=0,03400, 100=0,01400, 1000=0,00700, 10000=0,00400 (USD); RoHS: Yes; Mount: Surface Mount; Case/Package: 0402; Case Code (Imperial): 0402; Case Code (Metric): 1005; Contact Plating: Tin; Min Operating Temperature: -55°C; Max Operating Temperature: 155°C; Tolerance: 1%; Packaging: Tape and Reel; Package Quantity: 10000; Termination: SMD/SMT; Resistor Type: Thick Film; Number of Terminations: 2; Max Power Dissipation: 100mW; Voltage Rating (DC): 50V; Features: Automotive AEC-Q200; Series: ERJ; Construction: Rectangular; Resistance Tolerance: 1%; Length: 1mm; Width: 0.5mm; Height: 0.35mm; Depth: 0.5mm; Ratings: AEC-Q200; Reach SVHC Compliant: Yes; Military Standard: Not; Lead Free: Lead Free; RoHS Compliant: Yes; ComponentLink10URL: https://datasheet.ciiva.com/3883/3984280s8821682n1386-3883650.pdf?src-supplier=Arrow+Electronics; ComponentLink10Description: https://datasheet.ciiva.com/3883/3984280s8821682n1386-3883650.pdf?src-supplier=Arrow+Electronics; ComponentLink11URL: https://datasheet.ciiva.com/6201/426256-6201381.pdf?src-supplier=Farnell; ComponentLink11Description: https://datasheet.ciiva.com/6201/426256-6201381.pdf?src-supplier=Farnell; ComponentLink12URL: https://datasheet.ciiva.com/9188/aoa0000ce2-9188938.pdf?src-supplier=Avnet; ComponentLink12Description: https://datasheet.ciiva.com/9188/aoa0000ce2-9188938.pdf?src-supplier=Avnet; ComponentLink13URL: https://datasheet.ciiva.com/46389/426256-46389115.pdf?src-supplier=Element14; ComponentLink13Description: https://datasheet.ciiva.com/46389/426256-46389115.pdf?src-supplier=Element14; ComponentLink14URL: https://datasheet.ciiva.com/43460/426256-43460332.pdf?src-supplier=Farnell; ComponentLink14Description: https://datasheet.ciiva.com/43460/426256-43460332.pdf?src-supplier=Farnell; ComponentLink15URL: https://datasheet.ciiva.com/16781/70260748-16781070.pdf?src-supplier=Allied+Electronics; ComponentLink15Description: https://datasheet.ciiva.com/16781/70260748-16781070.pdf?src-supplier=Allied+Electronics
SB1-SB4 = SOLDER_BRIDGE_TRIANGULAR: Can be shorted out using solder paste or 0402-1206 resistor; Part Description: RES SMD 0.0OHM JUMPER 1/16W 0402; Manufacturer: Yageo; Manufacturer Part Number 1: RC0402JR-070RL; Power (Watts): 0.063W, 1/16W; Resistance (Ohms): 0.0; Tolerance: Jumper; Value: 0R; Category: Resistors; Composition: Thick Film; Features: Moisture Resistant; Height: 0.016" (0.40mm); Number of Terminations: 2; Operating Temperature: -55°C ~ 155°C; Package / Case: 0402 (1005 Metric); Packaging: Tape & Reel (TR); RoHS: RoHS Compliant; Size / Dimension: 0.039" L x 0.020" W (1.00mm x 0.50mm); Supplier 1: Digi-Key; Supplier Device Package: 0402; Supplier Part Number 1: 311-0.0JRTR-ND; Temperature Coefficient: -
VT4 = NDS331N: Manufacturer: Infineon Technologies; Part Description: N-Channel 20V 6.3A (Ta) 1.3W (Ta) Surface Mount Micro3™/SOT-23; FET Type: N-Channel; Current - Continuous Drain (Id) @ 25°C: 6.3A (Ta); Drive Voltage (Max Rds On,  Min Rds On): 2.5V, 4.5V; Vgs(th) (Max) @ Id: 1.1V @ 10µA; Gate Charge (Qg) (Max) @ Vgs: 8.9nC @ 4.5V; Input Capacitance (Ciss) (Max) @ Vds: 700pF @ 16V; Vgs (Max): ±12V; Power Dissipation (Max): 1.3W (Ta); Rds On (Max) @ Id, Vgs: 21 mOhm @ 6.3A, 4.5V; Supplier 1: Digi-Key; Supplier Part Number 1: IRLML6244TRPBFTR-ND; Manufacturer Part Number 1: IRLML6244TRPBF; RoHS: RoHS Compliant; Category: Discrete Semiconductor Products; Stock 1: 21000; Pricing 1: 3000=0.09979 (USD); Packaging: Tape & Reel (TR); Part Status: Active; Technology: MOSFET (Metal Oxide); FET Feature: -; Operating Temperature: -55°C ~ 150°C (TJ); Mounting Type: Surface Mount; Supplier Device Package: Micro3™/SOT-23; Package / Case: TO-236-3, SC-59, SOT-23-3; ComponentLink1URL: https://www.infineon.com/dgdl/irlml6244pbf.pdf?fileId=5546d462533600a4015356686fed261f; ComponentLink1Description: https://www.infineon.com/dgdl/irlml6244pbf.pdf?fileId=5546d462533600a4015356686fed261f
XO1 = Rakon_RTX5032A: Part Description: E7355LF 40MHz, High performance TCXO, With VC, 6-pin 5mm x 3.2 mm x 2.1 mm package; Manufacturer: Rakon; Manufacturer Part Number 1: E7355LF; Supplier Part Number 1: E7355LF; Supplier 1: RAKON

## Nets that join several sheets
GND: 05_LMS7002M_Misc (23 pins), 06_LMS7002M_RF (43 pins), 07_LMS7002M_Power (98 pins), 08_FPGA (164 pins), 09_USB3_0_FIFO (38 pins), 10_Misc (87 pins)
VCC1P1: 08_FPGA (24 pins), 10_Misc (C179.2 IC13.4 R74.2)
VCC1P8: 07_LMS7002M_Power (FR23.1), 10_Misc (10 pins)
VCC1P8_LMS: 06_LMS7002M_RF (13 pins), 07_LMS7002M_Power (15 pins)
VCC2P5: 08_FPGA (9 pins), 10_Misc (5 pins)
VCC3P3: 06_LMS7002M_RF (R14.1 R20.1), 08_FPGA (25 pins), 09_USB3_0_FIFO (20 pins), 10_Misc (27 pins)
VCC5P0: 06_LMS7002M_RF (R15.1 R21.1), 08_FPGA (J4.5 J5.7 R43.1), 09_USB3_0_FIFO (FR36.2), 10_Misc (7 pins)
VDIO_LMS: 05_LMS7002M_Misc (9 pins), 07_LMS7002M_Power (5 pins), 10_Misc (C198.2 FR45.2)
VDIO_LMS_FPGA: 08_FPGA (9 pins), 10_Misc (C197.2 FR45.1 R98.2 R101.2)
FAN_CTRL: 08_FPGA (IC7.A11), 10_Misc (VT4.G)
FPGA_CFG_SPI_MISO: 08_FPGA (IC7.T18), 10_Misc (IC15.2)
FPGA_CFG_SPI_MOSI: 08_FPGA (IC7.U18), 10_Misc (IC15.5)
FPGA_CFG_SPI_SCLK: 08_FPGA (IC7.U16), 10_Misc (IC15.6 R75.1)
FPGA_CFG_SPI_SS: 08_FPGA (IC7.U17), 10_Misc (IC15.1 R77.1)
FPGA_GPIO4: 08_FPGA (IC7.M18 J3.5), 10_Misc (SB1.2)
FPGA_GPIO5: 08_FPGA (IC7.R18 J3.6), 10_Misc (SB2.2)
FPGA_GPIO6: 08_FPGA (IC7.T17 J3.7), 10_Misc (SB3.2)
FPGA_GPIO7: 08_FPGA (IC7.R17 J3.8), 10_Misc (SB4.2)
FPGA_I2C_SCL: 08_FPGA (IC7.C10), 10_Misc (IC10.2 IC12.6 R70.2)
FPGA_I2C_SDA: 08_FPGA (IC7.B9), 10_Misc (IC10.1 IC12.5 R68.2)
FPGA_LED1_G: 08_FPGA (IC7.R16), 10_Misc (R85.2)
FPGA_LED1_R: 08_FPGA (IC7.V17), 10_Misc (R87.2)
FPGA_SPI_DAC_SS: 08_FPGA (IC7.L4), 10_Misc (IC11.1 IC16.5)
FPGA_SPI_LMS_SS: 05_LMS7002M_Misc (R11.2), 08_FPGA (IC7.N3)
FPGA_SPI_MISO: 05_LMS7002M_Misc (R10.2), 08_FPGA (IC7.K3)
FPGA_SPI_MOSI: 05_LMS7002M_Misc (R9.2), 08_FPGA (IC7.L3), 10_Misc (IC11.3 IC16.7)
FPGA_SPI_SCLK: 05_LMS7002M_Misc (R8.2), 08_FPGA (IC7.M3), 10_Misc (IC11.2 IC16.6)
FT_BE0: 08_FPGA (IC7.L15), 09_USB3_0_FIFO (IC8.4)
FT_BE1: 08_FPGA (IC7.J17), 09_USB3_0_FIFO (IC8.5)
FT_BE2: 08_FPGA (IC7.K16), 09_USB3_0_FIFO (IC8.6)
FT_BE3: 08_FPGA (IC7.H17), 09_USB3_0_FIFO (IC8.7)
FT_CLK: 08_FPGA (IC7.D17), 09_USB3_0_FIFO (R59.1)
FT_D0: 08_FPGA (IC7.A13), 09_USB3_0_FIFO (IC8.40)
FT_D1: 08_FPGA (IC7.B12), 09_USB3_0_FIFO (IC8.41)
FT_D2: 08_FPGA (IC7.B15), 09_USB3_0_FIFO (IC8.42)
FT_D3: 08_FPGA (IC7.C12), 09_USB3_0_FIFO (IC8.43)
FT_D4: 08_FPGA (IC7.A16), 09_USB3_0_FIFO (IC8.44)
FT_D5: 08_FPGA (IC7.A12), 09_USB3_0_FIFO (IC8.45)
FT_D6: 08_FPGA (IC7.D18), 09_USB3_0_FIFO (IC8.46)
FT_D7: 08_FPGA (IC7.B17), 09_USB3_0_FIFO (IC8.47)
FT_D8: 08_FPGA (IC7.F15), 09_USB3_0_FIFO (IC8.50)
FT_D9: 08_FPGA (IC7.D16), 09_USB3_0_FIFO (IC8.51)
FT_D10: 08_FPGA (IC7.D15), 09_USB3_0_FIFO (IC8.52)
FT_D11: 08_FPGA (IC7.C13), 09_USB3_0_FIFO (IC8.53)
FT_D12: 08_FPGA (IC7.H18), 09_USB3_0_FIFO (IC8.54)
FT_D13: 08_FPGA (IC7.B13), 09_USB3_0_FIFO (IC8.55)
FT_D14: 08_FPGA (IC7.J18), 09_USB3_0_FIFO (IC8.56)
FT_D15: 08_FPGA (IC7.A15), 09_USB3_0_FIFO (IC8.57)
FT_D16: 08_FPGA (IC7.B18), 09_USB3_0_FIFO (IC8.60)
FT_D17: 08_FPGA (IC7.C18), 09_USB3_0_FIFO (IC8.61)
FT_D18: 08_FPGA (IC7.A17), 09_USB3_0_FIFO (IC8.62)
FT_D19: 08_FPGA (IC7.K18), 09_USB3_0_FIFO (IC8.63)
FT_D20: 08_FPGA (IC7.C15), 09_USB3_0_FIFO (IC8.64)
FT_D21: 08_FPGA (IC7.L18), 09_USB3_0_FIFO (IC8.65)
FT_D22: 08_FPGA (IC7.F18), 09_USB3_0_FIFO (IC8.66)
FT_D23: 08_FPGA (IC7.C16), 09_USB3_0_FIFO (IC8.67)
FT_D24: 08_FPGA (IC7.G16), 09_USB3_0_FIFO (IC8.69)
FT_D25: 08_FPGA (IC7.D13), 09_USB3_0_FIFO (IC8.70)
FT_D26: 08_FPGA (IC7.G18), 09_USB3_0_FIFO (IC8.71)
FT_D27: 08_FPGA (IC7.F16), 09_USB3_0_FIFO (IC8.72)
FT_D28: 08_FPGA (IC7.C17), 09_USB3_0_FIFO (IC8.73)
FT_D29: 08_FPGA (IC7.F17), 09_USB3_0_FIFO (IC8.74)
FT_D30: 08_FPGA (IC7.K15), 09_USB3_0_FIFO (IC8.75)
FT_D31: 08_FPGA (IC7.K17), 09_USB3_0_FIFO (IC8.76)
FT_OEn: 08_FPGA (IC7.L16), 09_USB3_0_FIFO (IC8.13)
FT_RDn: 08_FPGA (IC7.H15), 09_USB3_0_FIFO (IC8.12)
FT_RESETn: 08_FPGA (IC7.M17), 09_USB3_0_FIFO (C132.1 IC8.15 R56.1)
FT_RXFn: 08_FPGA (IC7.H16), 09_USB3_0_FIFO (IC8.9)
FT_TXEn: 08_FPGA (IC7.M16), 09_USB3_0_FIFO (IC8.8)
FT_WAKEUPn: 08_FPGA (IC7.G15), 09_USB3_0_FIFO (IC8.16 R55.1)
FT_WRn: 08_FPGA (IC7.J16), 09_USB3_0_FIFO (IC8.11)
LM75_OS: 08_FPGA (IC7.K2), 10_Misc (IC10.3 R62.1)
LMK_CLK: 08_FPGA (IC7.A9), 10_Misc (IC9.13)
LMS_CORE_LDO_EN: 05_LMS7002M_Misc (IC1.U33 R7.1), 08_FPGA (IC7.C6)
LMS_DIQ1_D0: 05_LMS7002M_Misc (IC1.AG31), 08_FPGA (IC7.J2)
LMS_DIQ1_D1: 05_LMS7002M_Misc (IC1.AF30), 08_FPGA (IC7.L1)
LMS_DIQ1_D2: 05_LMS7002M_Misc (IC1.AF34), 08_FPGA (IC7.K1)
LMS_DIQ1_D3: 05_LMS7002M_Misc (IC1.AE31), 08_FPGA (IC7.K4)
LMS_DIQ1_D4: 05_LMS7002M_Misc (IC1.AD30), 08_FPGA (IC7.G3)
LMS_DIQ1_D5: 05_LMS7002M_Misc (IC1.AC29), 08_FPGA (IC7.F4)
LMS_DIQ1_D6: 05_LMS7002M_Misc (IC1.AE33), 08_FPGA (IC7.J1)
LMS_DIQ1_D7: 05_LMS7002M_Misc (IC1.AD32), 08_FPGA (IC7.H1)
LMS_DIQ1_D8: 05_LMS7002M_Misc (IC1.AC31), 08_FPGA (IC7.G4)
LMS_DIQ1_D9: 05_LMS7002M_Misc (IC1.AC33), 08_FPGA (IC7.F2)
LMS_DIQ1_D10: 05_LMS7002M_Misc (IC1.AB30), 08_FPGA (IC7.G1)
LMS_DIQ1_D11: 05_LMS7002M_Misc (IC1.AB32), 08_FPGA (IC7.H2)
LMS_DIQ2_D0: 05_LMS7002M_Misc (IC1.H30), 08_FPGA (IC7.A3)
LMS_DIQ2_D1: 05_LMS7002M_Misc (IC1.J31), 08_FPGA (IC7.C2)
LMS_DIQ2_D2: 05_LMS7002M_Misc (IC1.K30), 08_FPGA (IC7.A2)
LMS_DIQ2_D3: 05_LMS7002M_Misc (IC1.K32), 08_FPGA (IC7.B4)
LMS_DIQ2_D4: 05_LMS7002M_Misc (IC1.L31), 08_FPGA (IC7.C3)
LMS_DIQ2_D5: 05_LMS7002M_Misc (IC1.K34), 08_FPGA (IC7.B2)
LMS_DIQ2_D6: 05_LMS7002M_Misc (IC1.M30), 08_FPGA (IC7.D3)
LMS_DIQ2_D7: 05_LMS7002M_Misc (IC1.M32), 08_FPGA (IC7.B1)
LMS_DIQ2_D8: 05_LMS7002M_Misc (IC1.N31), 08_FPGA (IC7.A4)
LMS_DIQ2_D9: 05_LMS7002M_Misc (IC1.N33), 08_FPGA (IC7.C1)
LMS_DIQ2_D10: 05_LMS7002M_Misc (IC1.P30), 08_FPGA (IC7.C7)
LMS_DIQ2_D11: 05_LMS7002M_Misc (IC1.P32), 08_FPGA (IC7.A6)
LMS_EN_IQSEL1: 05_LMS7002M_Misc (IC1.Y32), 08_FPGA (IC7.F3)
LMS_EN_IQSEL2: 05_LMS7002M_Misc (IC1.R33), 08_FPGA (IC7.C4)
LMS_FCLK1: 05_LMS7002M_Misc (IC1.AA33), 08_FPGA (IC7.H3)
LMS_FCLK2: 05_LMS7002M_Misc (IC1.R29), 08_FPGA (IC7.D1)
LMS_MCLK1: 05_LMS7002M_Misc (IC1.AB34), 08_FPGA (IC7.H4)
LMS_MCLK2: 05_LMS7002M_Misc (IC1.P34), 08_FPGA (IC7.D2)
LMS_RESET: 05_LMS7002M_Misc (IC1.E27 R4.1), 08_FPGA (IC7.A7)
LMS_RXEN: 05_LMS7002M_Misc (IC1.V34 R6.2), 08_FPGA (IC7.D6)
LMS_TXEN: 05_LMS7002M_Misc (IC1.U29 R5.2), 08_FPGA (IC7.B7)
LMS_TXNRX1: 05_LMS7002M_Misc (IC1.V32 R3.1), 08_FPGA (IC7.F1)
LMS_TXNRX2: 05_LMS7002M_Misc (IC1.U31 R12.1), 08_FPGA (IC7.B6)
RFSW_RX_V1: 06_LMS7002M_RF (C29.2 IC4.5), 08_FPGA (IC7.C11)
RFSW_RX_V2: 06_LMS7002M_RF (C28.2 IC4.2), 08_FPGA (IC7.B11)
RFSW_TX_V1: 06_LMS7002M_RF (C14.2 IC3.5), 08_FPGA (IC7.B10)
RFSW_TX_V2: 06_LMS7002M_RF (C13.2 IC3.2), 08_FPGA (IC7.C9)
RxPLL_CLK: 05_LMS7002M_Misc (IC1.AM24), 10_Misc (C160.2 R69.1)
TX_LB_AT: 06_LMS7002M_RF (C19.1 R17.2), 08_FPGA (IC7.C8)
TX_LB_SH: 06_LMS7002M_RF (C20.1 C23.1 R24.1 R25.2), 08_FPGA (IC7.B8)
TxPLL_CLK: 05_LMS7002M_Misc (IC1.E5), 10_Misc (C158.2 R65.1)